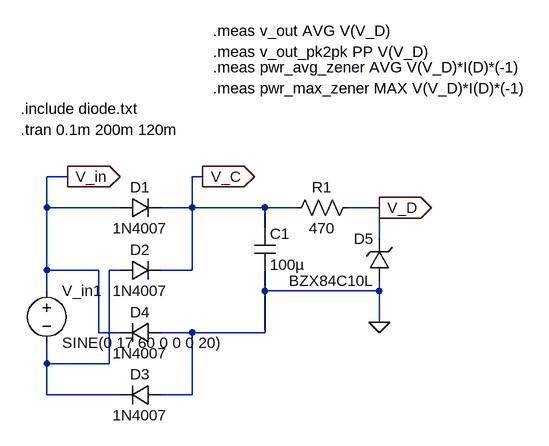
[diagram p0: schematic Draft1.asc]
Draft1.asc, the LTspice schematic file:
Version 4
SHEET 1 932 680
WIRE 80 112 48 112
WIRE 288 112 272 112
WIRE 48 160 48 112
WIRE 160 160 48 160
WIRE 272 160 272 112
WIRE 272 160 224 160
WIRE 384 160 272 160
WIRE 432 160 384 160
WIRE 560 160 512 160
WIRE 384 192 384 160
WIRE 560 208 560 160
WIRE 48 256 48 160
WIRE 128 256 48 256
WIRE 160 256 144 256
WIRE 272 256 272 160
WIRE 272 256 224 256
WIRE 48 288 48 256
WIRE 384 288 384 256
WIRE 560 288 560 272
WIRE 560 288 384 288
WIRE 560 336 560 288
WIRE 128 352 128 256
WIRE 160 352 128 352
WIRE 272 352 224 352
WIRE 384 352 384 288
WIRE 384 352 272 352
WIRE 48 400 48 368
WIRE 144 400 144 256
WIRE 144 400 48 400
WIRE 48 448 48 400
WIRE 160 448 48 448
WIRE 272 448 272 352
WIRE 272 448 224 448
FLAG 560 336 0
FLAG 288 112 V_C
IOPIN 288 112 Out
FLAG 80 112 V_in
IOPIN 80 112 Out
FLAG 560 160 V_D
IOPIN 560 160 Out
SYMBOL voltage 48 272 R0
SYMATTR InstName V_in1
SYMATTR Value SINE(0 17 60 0 0 0 20)
SYMBOL diode 160 176 R270
WINDOW 0 32 32 VTop 2
WINDOW 3 0 32 VBottom 2
SYMATTR InstName D1
SYMATTR Value 1N4007
SYMBOL diode 160 272 R270
WINDOW 0 32 32 VTop 2
WINDOW 3 0 32 VBottom 2
SYMATTR InstName D2
SYMATTR Value 1N4007
SYMBOL diode 224 432 R90
WINDOW 0 0 32 VBottom 2
WINDOW 3 32 32 VTop 2
SYMATTR InstName D3
SYMATTR Value 1N4007
SYMBOL diode 224 336 R90
WINDOW 0 0 32 VBottom 2
WINDOW 3 32 32 VTop 2
SYMATTR InstName D4
SYMATTR Value 1N4007
SYMBOL cap 368 192 R0
SYMATTR InstName C1
SYMATTR Value 100µ
SYMBOL zener 576 272 R180
WINDOW 0 24 64 Left 2
WINDOW 3 24 0 Left 2
SYMATTR InstName D5
SYMATTR Value BZX84C10L
SYMBOL res 528 144 R90
WINDOW 0 0 56 VBottom 2
WINDOW 3 32 56 VTop 2
SYMATTR InstName R1
SYMATTR Value 470
TEXT 8 8 Left 2 !.include diode.txt
TEXT 8 40 Left 2 !.tran 0.1m 200m 120m
TEXT 304 -112 Left 2 !.meas v_out AVG V(V_D)
TEXT 304 -80 Left 2 !.meas v_out_pk2pk PP V(V_D)
TEXT 304 -56 Left 2 !.meas pwr_avg_zener AVG V(V_D)*I(D)*(-1)
TEXT 304 -24 Left 2 !.meas pwr_max_zener MAX V(V_D)*I(D)*(-1)

The netlist it stands for:
* Draft1.asc
V_in1 V_in N001 SINE(0 17 60 0 0 0 20)
D1 V_in V_C 1N4007
D2 N001 V_C 1N4007
D3 0 N001 1N4007
D4 0 V_in 1N4007
C1 V_C 0 100µ
D5 0 V_D BZX84C10L
R1 V_D V_C 470
.model D D
.lib standard.dio
.include diode.txt
.tran 0.1m 200m 120m
.meas v_out AVG V(V_D)
.meas v_out_pk2pk PP V(V_D)
.meas pwr_avg_zener AVG V(V_D)*I(D)*(-1)
.meas pwr_max_zener MAX V(V_D)*I(D)*(-1)
.backanno
.end